# EAGLE schematic alpha (EAGLE 6.4)
DATABASE: ../../EagleStuff/parts_database.txt
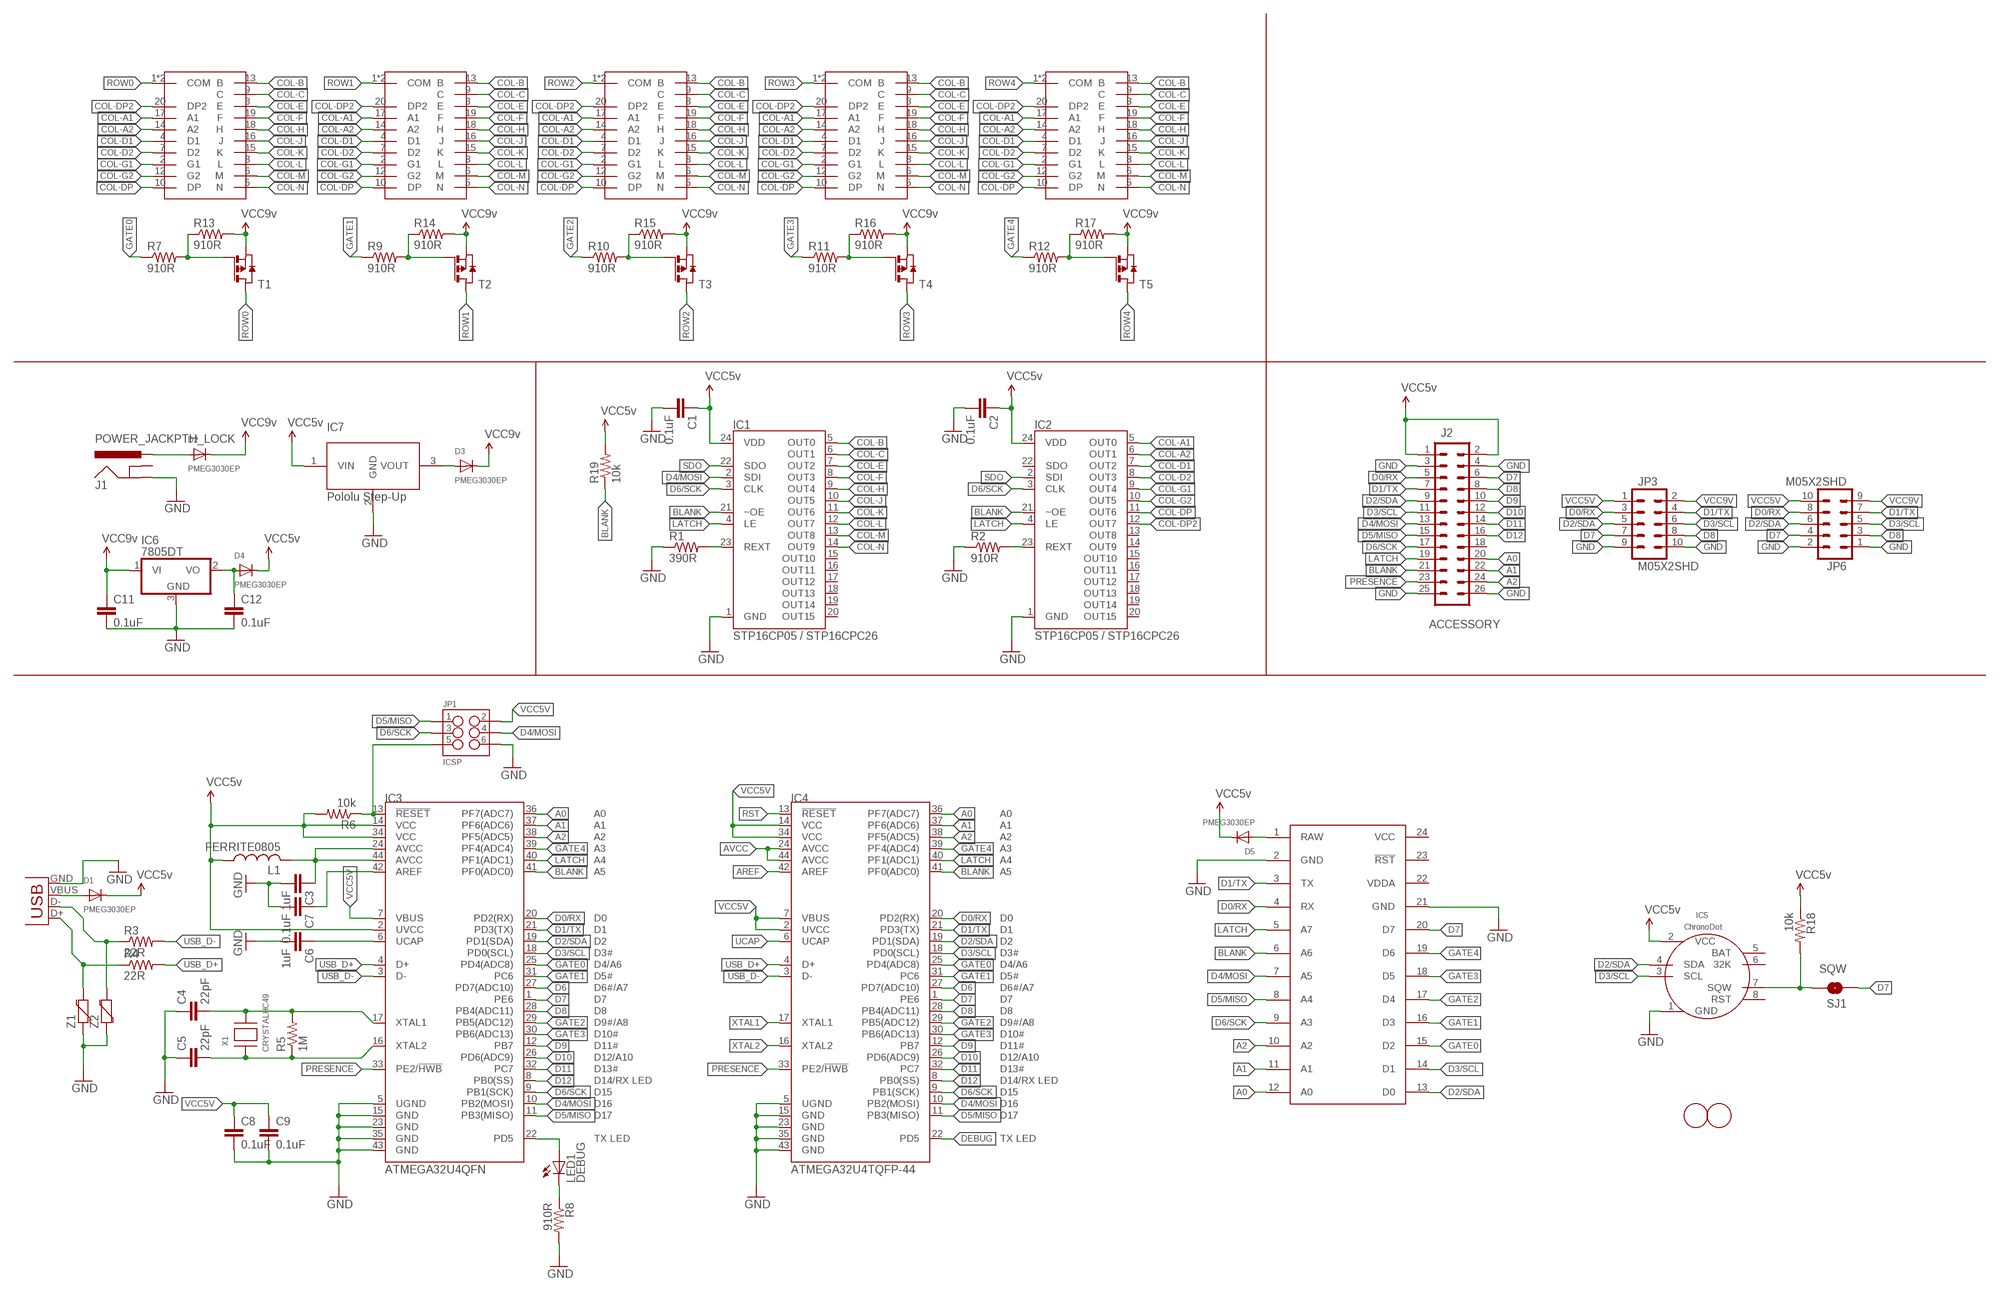
[diagram p0: schematic, sheet 1]

## Parts
C1  0.1uF  CAP0805  [0805]
C2  0.1uF  CAP0805  [0805]
C3  1uF  CAP0805  [0805]
C4  22pF  CAP0805  [0805]
C5  22pF  CAP0805  [0805]
C6  1uF  CAP0805  [0805]
C7  0.1uF  CAP0805  [0805]
C8  0.1uF  CAP0805  [0805]
C9  0.1uF  CAP0805  [0805]
C11  0.1uF  CAP0805  [0805]
C12  0.1uF  CAP0805  [0805]
CORE  Spark Core  SPARK_CORECORE  [SPARK_CORE]
D1  PMEG3030EP  DIODESOD-128  [SOD-128]
D2  PMEG3030EP  DIODESOD-128  [SOD-128]
D3  PMEG3030EP  DIODESOD-128  [SOD-128]
D4  PMEG3030EP  DIODESOD-128  [SOD-128]
D5  PMEG3030EP  DIODESOD-128  [SOD-128]
IC1  STP16CP05 / STP16CPC26  STP16CP05  [SO-24DW]
IC2  STP16CP05 / STP16CPC26  STP16CP05  [SO-24DW]
IC3  ATMEGA32U4QFN  [QFN-44]
IC4  ATMEGA32U4TQFP-44  [TQFP44]
IC5  CHRONODOT  [CHRONODOT]
IC6  7805DT  [TO252]
IC7  Pololu Step-Up  POLOLU_REG  [1X03_LOCK]
J1  POWER_JACKPTH_LOCK  [POWER_JACK_PTH_LOCK]
J2  ACCESSORY  HEADER-M26  [2X13]
JP1  ICSP  M03X2NO_SILK  [2X3-NS]
JP2  USBSMD  [USB-MINIB]
JP3  M05X2SHD  [2X5-SHROUDED]
JP6  M05X2SHD  [2X5-SHROUDED]
L1  FERRITE0805  [0805]
LED1  DEBUG  LEDCHIP-LED0805  [CHIP-LED0805]
R1  390R  RESISTOR0805-RES  [0805]
R2  910R  RESISTOR0805-RES  [0805]
R3  22R  RESISTOR0805-RES  [0805]
R4  22R  RESISTOR0805-RES  [0805]
R5  1M  RESISTOR0805-RES  [0805]
R6  10k  RESISTOR0805-RES  [0805]
R7  910R  RESISTOR0805-RES  [0805]
R8  910R  RESISTOR0805-RES  [0805]
R9  910R  RESISTOR0805-RES  [0805]
R10  910R  RESISTOR0805-RES  [0805]
R11  910R  RESISTOR0805-RES  [0805]
R12  910R  RESISTOR0805-RES  [0805]
R13  910R  RESISTOR0805-RES  [0805]
R14  910R  RESISTOR0805-RES  [0805]
R15  910R  RESISTOR0805-RES  [0805]
R16  910R  RESISTOR0805-RES  [0805]
R17  910R  RESISTOR0805-RES  [0805]
R18  10k  RESISTOR0805-RES  [0805]
R19  10k  RESISTOR0805-RES  [0805]
SEG1  BL-S230X-12  [BL-S230X-12]
SEG2  BL-S230X-12  [BL-S230X-12]
SEG3  BL-S230X-12  [BL-S230X-12]
SEG4  BL-S230X-12  [BL-S230X-12]
SEG5  BL-S230X-12  [BL-S230X-12]
SJ1  SQW  SOLDERJUMPERNO  [SJ_2S-NO]
T1  PMOSSOT23  [SOT-23]
T2  PMOSSOT23  [SOT-23]
T3  PMOSSOT23  [SOT-23]
T4  PMOSSOT23  [SOT-23]
T5  PMOSSOT23  [SOT-23]
U$1  FIDUCIAL  [FIDUCIAL_1MM]
U$2  FIDUCIAL  [FIDUCIAL_1MM]
X1  CRYSTALHC49  [HC49]
Z1  VARISTOR-0603  [0603-RES]
Z2  VARISTOR-0603  [0603-RES]

## Nets
A0: CORE.12(A0) IC3.36(PF7(ADC7)) IC4.36(PF7(ADC7)) J2.20
A1: CORE.11(A1) IC3.37(PF6(ADC6)) IC4.37(PF6(ADC6)) J2.22
A2: CORE.10(A2) IC3.38(PF5(ADC5)) IC4.38(PF5(ADC5)) J2.24
AREF: C7.1 IC3.42(AREF) IC4.42(AREF)
AVCC: C3.1 IC3.24(AVCC) IC3.44(AVCC) IC4.24(AVCC) IC4.44(AVCC) L1.2
BLANK: CORE.6(A6) IC1.21(~OE) IC2.21(~OE) IC3.41(PF0(ADC0)) IC4.41(PF0(ADC0)) J2.21 R19.1
COL-A1: IC2.5(OUT0) SEG1.17(A1) SEG2.17(A1) SEG3.17(A1) SEG4.17(A1) SEG5.17(A1)
COL-A2: IC2.6(OUT1) SEG1.14(A2) SEG2.14(A2) SEG3.14(A2) SEG4.14(A2) SEG5.14(A2)
COL-B: IC1.5(OUT0) SEG1.13(B) SEG2.13(B) SEG3.13(B) SEG4.13(B) SEG5.13(B)
COL-C: IC1.6(OUT1) SEG1.9(C) SEG2.9(C) SEG3.9(C) SEG4.9(C) SEG5.9(C)
COL-D1: IC2.7(OUT2) SEG1.4(D1) SEG2.4(D1) SEG3.4(D1) SEG4.4(D1) SEG5.4(D1)
COL-D2: IC2.8(OUT3) SEG1.7(D2) SEG2.7(D2) SEG3.7(D2) SEG4.7(D2) SEG5.7(D2)
COL-DP: IC2.11(OUT6) SEG1.10(DP) SEG2.10(DP) SEG3.10(DP) SEG4.10(DP) SEG5.10(DP)
COL-DP2: IC2.12(OUT7) SEG1.20(DP2) SEG2.20(DP2) SEG3.20(DP2) SEG4.20(DP2) SEG5.20(DP2)
COL-E: IC1.7(OUT2) SEG1.3(E) SEG2.3(E) SEG3.3(E) SEG4.3(E) SEG5.3(E)
COL-F: IC1.8(OUT3) SEG1.19(F) SEG2.19(F) SEG3.19(F) SEG4.19(F) SEG5.19(F)
COL-G1: IC2.9(OUT4) SEG1.2(G1) SEG2.2(G1) SEG3.2(G1) SEG4.2(G1) SEG5.2(G1)
COL-G2: IC2.10(OUT5) SEG1.12(G2) SEG2.12(G2) SEG3.12(G2) SEG4.12(G2) SEG5.12(G2)
COL-H: IC1.9(OUT4) SEG1.18(H) SEG2.18(H) SEG3.18(H) SEG4.18(H) SEG5.18(H)
COL-J: IC1.10(OUT5) SEG1.16(J) SEG2.16(J) SEG3.16(J) SEG4.16(J) SEG5.16(J)
COL-K: IC1.11(OUT6) SEG1.15(K) SEG2.15(K) SEG3.15(K) SEG4.15(K) SEG5.15(K)
COL-L: IC1.12(OUT7) SEG1.8(L) SEG2.8(L) SEG3.8(L) SEG4.8(L) SEG5.8(L)
COL-M: IC1.13(OUT8) SEG1.6(M) SEG2.6(M) SEG3.6(M) SEG4.6(M) SEG5.6(M)
COL-N: IC1.14(OUT9) SEG1.5(N) SEG2.5(N) SEG3.5(N) SEG4.5(N) SEG5.5(N)
D0/RX: CORE.4(RX) IC3.20(PD2(RX)) IC4.20(PD2(RX)) J2.5 JP3.3 JP6.8
D1/TX: CORE.3(TX) IC3.21(PD3(TX)) IC4.21(PD3(TX)) J2.7 JP3.4 JP6.7
D2/SDA: CORE.13(D0) IC3.19(PD1(SDA)) IC4.19(PD1(SDA)) IC5.4(SDA) J2.9 JP3.5 JP6.6
D3/SCL: CORE.14(D1) IC3.18(PD0(SCL)) IC4.18(PD0(SCL)) IC5.3(SCL) J2.11 JP3.6 JP6.5
D4/MOSI: CORE.7(A5) IC1.2(SDI) IC3.10(PB2(MOSI)) IC4.10(PB2(MOSI)) J2.13 JP1.4
D5/MISO: CORE.8(A4) IC3.11(PB3(MISO)) IC4.11(PB3(MISO)) J2.15 JP1.1
D6: IC3.27(PD7(ADC10)) IC4.27(PD7(ADC10))
D6/SCK: CORE.9(A3) IC1.3(CLK) IC2.3(CLK) IC3.9(PB1(SCK)) IC4.9(PB1(SCK)) J2.17 JP1.3
D7: CORE.20(D7) IC3.1(PE6) IC4.1(PE6) J2.6 JP3.7 JP6.4 SJ1.1
D8: IC3.28(PB4(ADC11)) IC4.28(PB4(ADC11)) J2.8 JP3.8 JP6.3
D9: IC3.12(PB7) IC4.12(PB7) J2.10
D10: IC3.26(PD6(ADC9)) IC4.26(PD6(ADC9)) J2.12
D11: IC3.32(PC7) IC4.32(PC7) J2.14
D12: IC3.8(PB0(SS)) IC4.8(PB0(SS)) J2.16
DEBUG: IC3.22(PD5) IC4.22(PD5) LED1.A
GATE0: CORE.15(D2) IC3.25(PD4(ADC8)) IC4.25(PD4(ADC8)) R7.1
GATE1: CORE.16(D3) IC3.31(PC6) IC4.31(PC6) R9.1
GATE2: CORE.17(D4) IC3.29(PB5(ADC12)) IC4.29(PB5(ADC12)) R10.1
GATE3: CORE.18(D5) IC3.30(PB6(ADC13)) IC4.30(PB6(ADC13)) R11.1
GATE4: CORE.19(D6) IC3.39(PF4(ADC4)) IC4.39(PF4(ADC4)) R12.1
GND: C1.2 C2.2 C3.2 C4.1 C5.1 C6.2 C7.2 C8.2 C9.2 C11.2 C12.2 CORE.2(GND) CORE.21(GND) IC1.1(GND) IC2.1(GND) IC3.5(UGND) IC3.15(GND) IC3.23(GND) IC3.35(GND) IC3.43(GND) IC4.5(UGND) IC4.15(GND) IC4.23(GND) IC4.35(GND) IC4.43(GND) IC5.1(GND) IC6.3(GND) IC7.2(GND) J1.GND J2.3 J2.4 J2.25 J2.26 JP1.6 JP2.GND JP3.9 JP3.10 JP6.1 JP6.2 R1.1 R2.1 R8.2 Z1.1 Z2.1
LATCH: CORE.5(A7) IC1.4(LE) IC2.4(LE) IC3.40(PF1(ADC1)) IC4.40(PF1(ADC1)) J2.19
N$1: IC1.23(REXT) R1.2
N$2: IC2.23(REXT) R2.2
N$3: D1.A JP2.VBUS
N$4: JP2.D- R3.1 Z2.2
N$5: JP2.D+ R4.1 Z1.2
N$6: D2.A J1.PWR
N$7: LED1.C R8.1
N$8: R11.2 R16.1 T4.3(G)
N$9: R7.2 R13.1 T1.3(G)
N$10: R9.2 R14.1 T2.3(G)
N$11: R10.2 R15.1 T3.3(G)
N$12: R12.2 R17.1 T5.3(G)
N$13: D3.A IC7.3(VOUT)
N$14: IC5.7(SQW) R18.2 SJ1.2
N$15: CORE.1(RAW) D5.A
N$16: C12.1 D4.A IC6.2(VO)
PRESENCE: IC3.33(PE2/!HWB) IC4.33(PE2/!HWB) J2.23
ROW0: SEG1.1(COM) SEG1.11(COM) T1.1(D)
ROW1: SEG2.1(COM) SEG2.11(COM) T2.1(D)
ROW2: SEG3.1(COM) SEG3.11(COM) T3.1(D)
ROW3: SEG4.1(COM) SEG4.11(COM) T4.1(D)
ROW4: SEG5.1(COM) SEG5.11(COM) T5.1(D)
RST: IC3.13(!RESET) IC4.13(!RESET) JP1.5 R6.1
SDO: IC1.22(SDO) IC2.2(SDI)
UCAP: C6.1 IC3.6(UCAP) IC4.6(UCAP)
USB_D+: IC3.4(D+) IC4.4(D+) R4.2
USB_D-: IC3.3(D-) IC4.3(D-) R3.2
VCC5V: C1.1 C2.1 C8.1 C9.1 D1.C D4.C D5.C IC1.24(VDD) IC2.24(VDD) IC3.2(UVCC) IC3.7(VBUS) IC3.14(VCC) IC3.34(VCC) IC4.2(UVCC) IC4.7(VBUS) IC4.14(VCC) IC4.34(VCC) IC5.2(VCC) IC7.1(VIN) J2.1 J2.2 JP1.2 JP3.1 JP6.10 L1.1 R6.2 R18.1 R19.2 ; supply symbol labelled VCC5v
VCC9V: C11.1 D2.C D3.C IC6.1(VI) JP3.2 JP6.9 R13.2 R14.2 R15.2 R16.2 R17.2 T1.2(S) T2.2(S) T3.2(S) T4.2(S) T5.2(S) ; supply symbol labelled VCC9v
XTAL1: C4.2 IC3.17(XTAL1) IC4.17(XTAL1) R5.2 X1.2
XTAL2: C5.2 IC3.16(XTAL2) IC4.16(XTAL2) R5.1 X1.1
Unconnected: CORE.23(!RST) IC1.15(OUT10) IC1.16(OUT11) IC1.17(OUT12) IC1.18(OUT13) IC1.19(OUT14) IC1.20(OUT15) IC2.13(OUT8) IC2.14(OUT9) IC2.15(OUT10) IC2.16(OUT11) IC2.17(OUT12) IC2.18(OUT13) IC2.19(OUT14) IC2.20(OUT15) IC2.22(SDO) IC5.5(BAT) IC5.6(32K) IC5.8(RST) J1.GNDBREAK J2.18

## Power pins joined to a net without a drawn wire
VCC5V: CORE.24(VCC)
VDDA: CORE.22(VDDA)

## Library data of the parts
C1 C2 C7-C9 C11 C12 = SparkFun-Capacitors:CAP: Capacitor Standard 0603 ceramic capacitor, and 0.1" leaded capacitor.; PARTNO: C0805C104K5RACTU
C3 C6 = SparkFun-Capacitors:CAP: Capacitor Standard 0603 ceramic capacitor, and 0.1" leaded capacitor.; PARTNO: CL21B105KBFNNNE
C4 C5 = SparkFun-Capacitors:CAP: Capacitor Standard 0603 ceramic capacitor, and 0.1" leaded capacitor.; PARTNO: C0805C220J5GACTU
CORE = Spark:SPARK_CORE
D1-D5 = digits:DIODE; PARTNO: PMEG3030EP-115
IC1 IC2 = SparkFun-DigitalIC:STP16CP05: 16-pin constant current sink shift register LED driver; PARTNO: STP16CPC26MTR
IC3 = SparkFun-DigitalIC:ATMEGA32U4: Atmel 44-pin 8-bit Microcontroller with 32KBytes of ISP Flash and USB Controller; PARTNO: ATMEGA32U4-MUR
IC4 = SparkFun-DigitalIC:ATMEGA32U4: Atmel 44-pin 8-bit Microcontroller with 32KBytes of ISP Flash and USB Controller; PARTNO: ATMEGA32U4-AU
IC5 = digits:CHRONODOT
IC6 = adafruit:78*: Positive VOLTAGE REGULATOR Added bigger pads to the TO-92 package
IC7 = alpha:POLOLU_REG
J1 = SparkFun-Connectors:POWER_JACK: Power Jack This is the standard 5.5mm barrel jack for power. The PTH is the most common, proven, reliable, footprint. The Slot footprint only works if the mill layer is transmitted to the PCB fab house so be warned. Spark Fun Electronics SKU : PRT-00119 SMT: CONN-08106 Mating wall wart : TOL-00298 (and others); PARTNO: PJ-202A
J2 = digits:HEADER-M26; PARTNO: SFH11-PBPC-D13-ST-BK
JP1 = SparkFun-Connectors:M03X2: 2x3 .1" header. Shrouded, with keying- CONN-10681 SMT- CONN-11415 Pogo pins- HW-11044; PARTNO: M20-9980346
JP2 = SparkFun-Connectors:USB: USB Connectors USB-B-PTH is fully proven SKU : PRT-00139/CONN-08278 USB-miniB is fully proven SKU : PRT-00587 USB-A-PCB is untested. USB-A-H is throughly reviewed, but untested. Spark Fun Electronics SKU : PRT-00437 USB-B-SMT is throughly reviewed, but untested. Needs silkscreen touching up. USB-A-S has not been used/tested USB-MB-H has not been used/tested USB-MICROB has been used. CONN-09505; PARTNO: 690-005-299-043; PROD_ID: CONN-08193
JP3 JP6 = SparkFun-Connectors:M05X2: Header 5x2 Standard 10-pin dual row 0.1" header. Commonly used with AVR-ISP. Use with Spark Fun Electronics SKU: PRT-00778; PARTNO: 302-S101
L1 = digits:FERRITE; PARTNO: CIM21J601NE
LED1 = adafruit:LED: LED OSRAM: - CHIPLED LG R971, LG N971, LY N971, LG Q971, LY Q971, LO R971, LY R971 LH N974, LH R974 LS Q976, LO Q976, LY Q976 LO Q996 - Hyper CHIPLED LW Q18S LB Q993, LB Q99A, LB R99A - SideLED LS A670, LO A670, LY A670, LG A670, LP A670 LB A673, LV A673, LT A673, LW A673 LH A674 LY A675 LS A676, LA A676, LO A676, LY A676, LW A676 LS A679, LY A679, LG A679 - Hyper Micro SIDELED® LS Y876, LA Y876, LO Y876, LY Y876 LT Y87S - SmartLED LW L88C, LW L88S LB L89C, LB L89S, LG L890 LS L89K, LO L89K, LY L89K LS L896, LA L896, LO L896, LY L896 - TOPLED LS T670, LO T670, LY T670, LG T670, LP T670 LSG T670, LSP T670, LSY T670, LOP T670, LYG T670 LG T671, LOG T671, LSG T671 LB T673, LV T673, LT T673, LW T673 LH T674 LS T676, LA T676, LO T676, LY T676, LB T676, LH T676, LSB T676, LW T676 LB T67C, LV T67C, LT T67C, LS T67K, LO T67K, LY T67K, LW E67C LS E67B, LA E67B, LO E67B, LY E67B, LB E67C, LV E67C, LT E67C LW T67C LS T679, LY T679, LG T679 LS T770, LO T770, LY T770, LG T770, LP T770 LB T773, LV T773, LT T773, LW T773 LH T774 LS E675, LA E675, LY E675, LS T675 LS T776, LA T776, LO T776, LY T776, LB T776 LHGB T686 LT T68C, LB T68C - Hyper Mini TOPLED® LB M676 - Mini TOPLED Santana® LG M470 LS M47K, LO M47K, LY M47K Source: http://www.osram.convergy.de/; PARTNO: LG R971-KN-1
R1 = SparkFun-Resistors:RESISTOR: Resistor Basic schematic elements and footprints for 0603, 1206, and PTH resistors.; PARTNO: RC0805FR-07390RL
R2 R7-R17 = SparkFun-Resistors:RESISTOR: Resistor Basic schematic elements and footprints for 0603, 1206, and PTH resistors.; PARTNO: MCR10ERTF9100
R3 R4 = SparkFun-Resistors:RESISTOR: Resistor Basic schematic elements and footprints for 0603, 1206, and PTH resistors.; PARTNO: RC0805FR-0722RL
R5 = SparkFun-Resistors:RESISTOR: Resistor Basic schematic elements and footprints for 0603, 1206, and PTH resistors.; PARTNO: RC0805FR-071ML
R6 R18 = SparkFun-Resistors:RESISTOR: Resistor Basic schematic elements and footprints for 0603, 1206, and PTH resistors.; PARTNO: RC0805JR-0710KL
R19 = SparkFun-Resistors:RESISTOR: Resistor Basic schematic elements and footprints for 0603, 1206, and PTH resistors.
SEG1-SEG5 = digits:BL-S230X-12
SJ1 = SparkFun-Passives:SOLDERJUMPER: Solder Jumper Standard SMD solder jumper. Used to automate production. Two varients : Normally Open and Normally Closed are the same, but have different paste layers. NC will have a large amount of paste and should jumper during reflow.
T1-T5 = zetex:PMOSSOT23: MOS FET; OC_FARNELL: unknown; OC_NEWARK: unknown; PARTNO: FDN352AP
U$1 U$2 = adafruit:FIDUCIAL: For use by pick and place machines to calibrate the vision/machine, 1mm By microbuilder.eu
X1 = digits:CRYSTAL; PARTNO: 9C-16.000MAAJ-T
Z1 Z2 = SparkFun-DiscreteSemi:VARISTOR: Varistor Varistor (Variable resistor) is a nonlinear resistive element of the voltage dependence that resistance changes with applied voltage. Varistor is equivalent with Zener diode of two series connection.; PARTNO: CG0603MLC-05E